# EAGLE board CFT-PB2-smd-old (EAGLE 5.11)
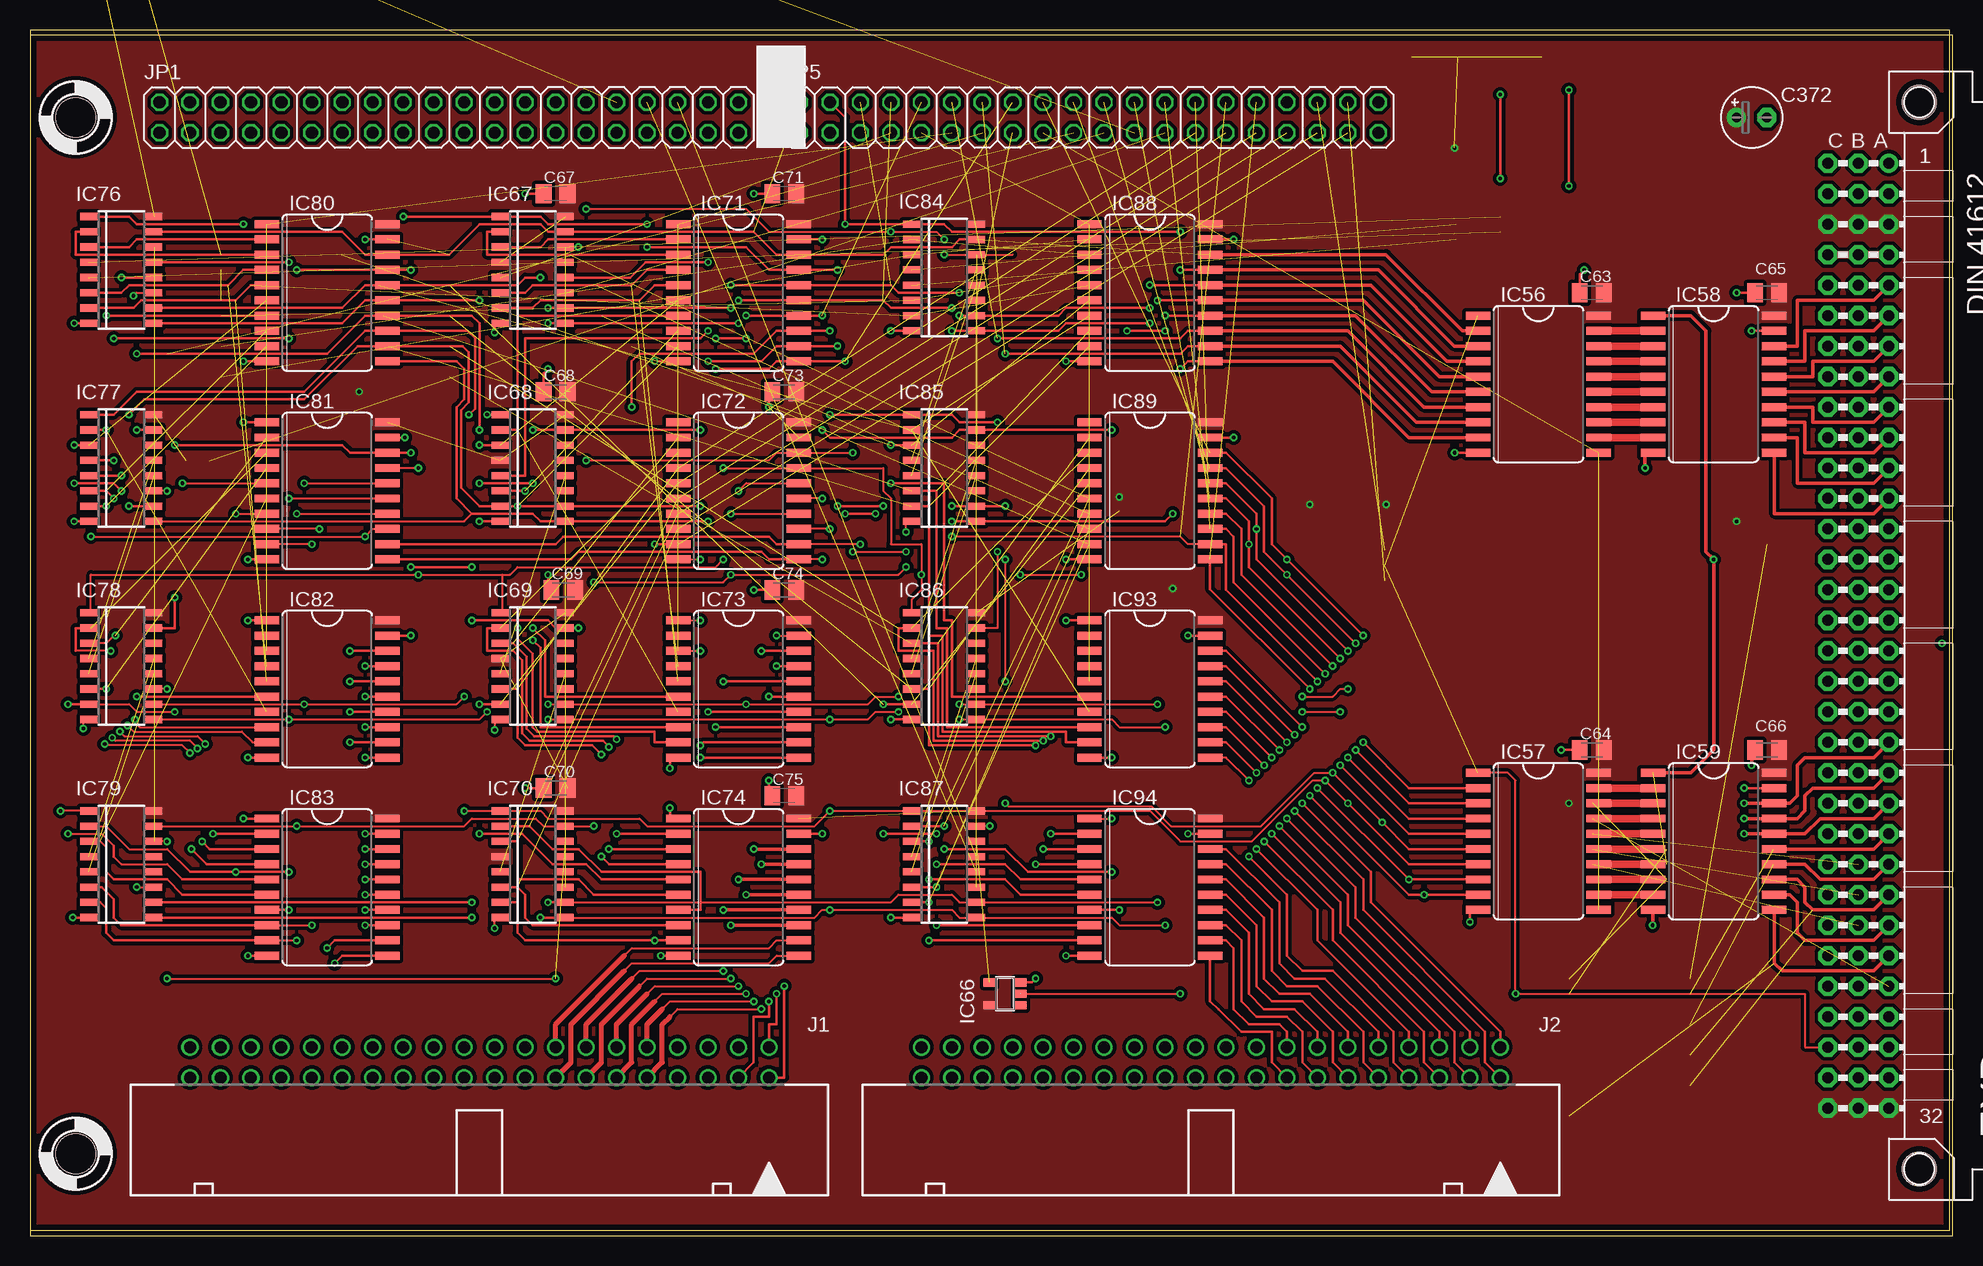
[diagram p6: board, top side]
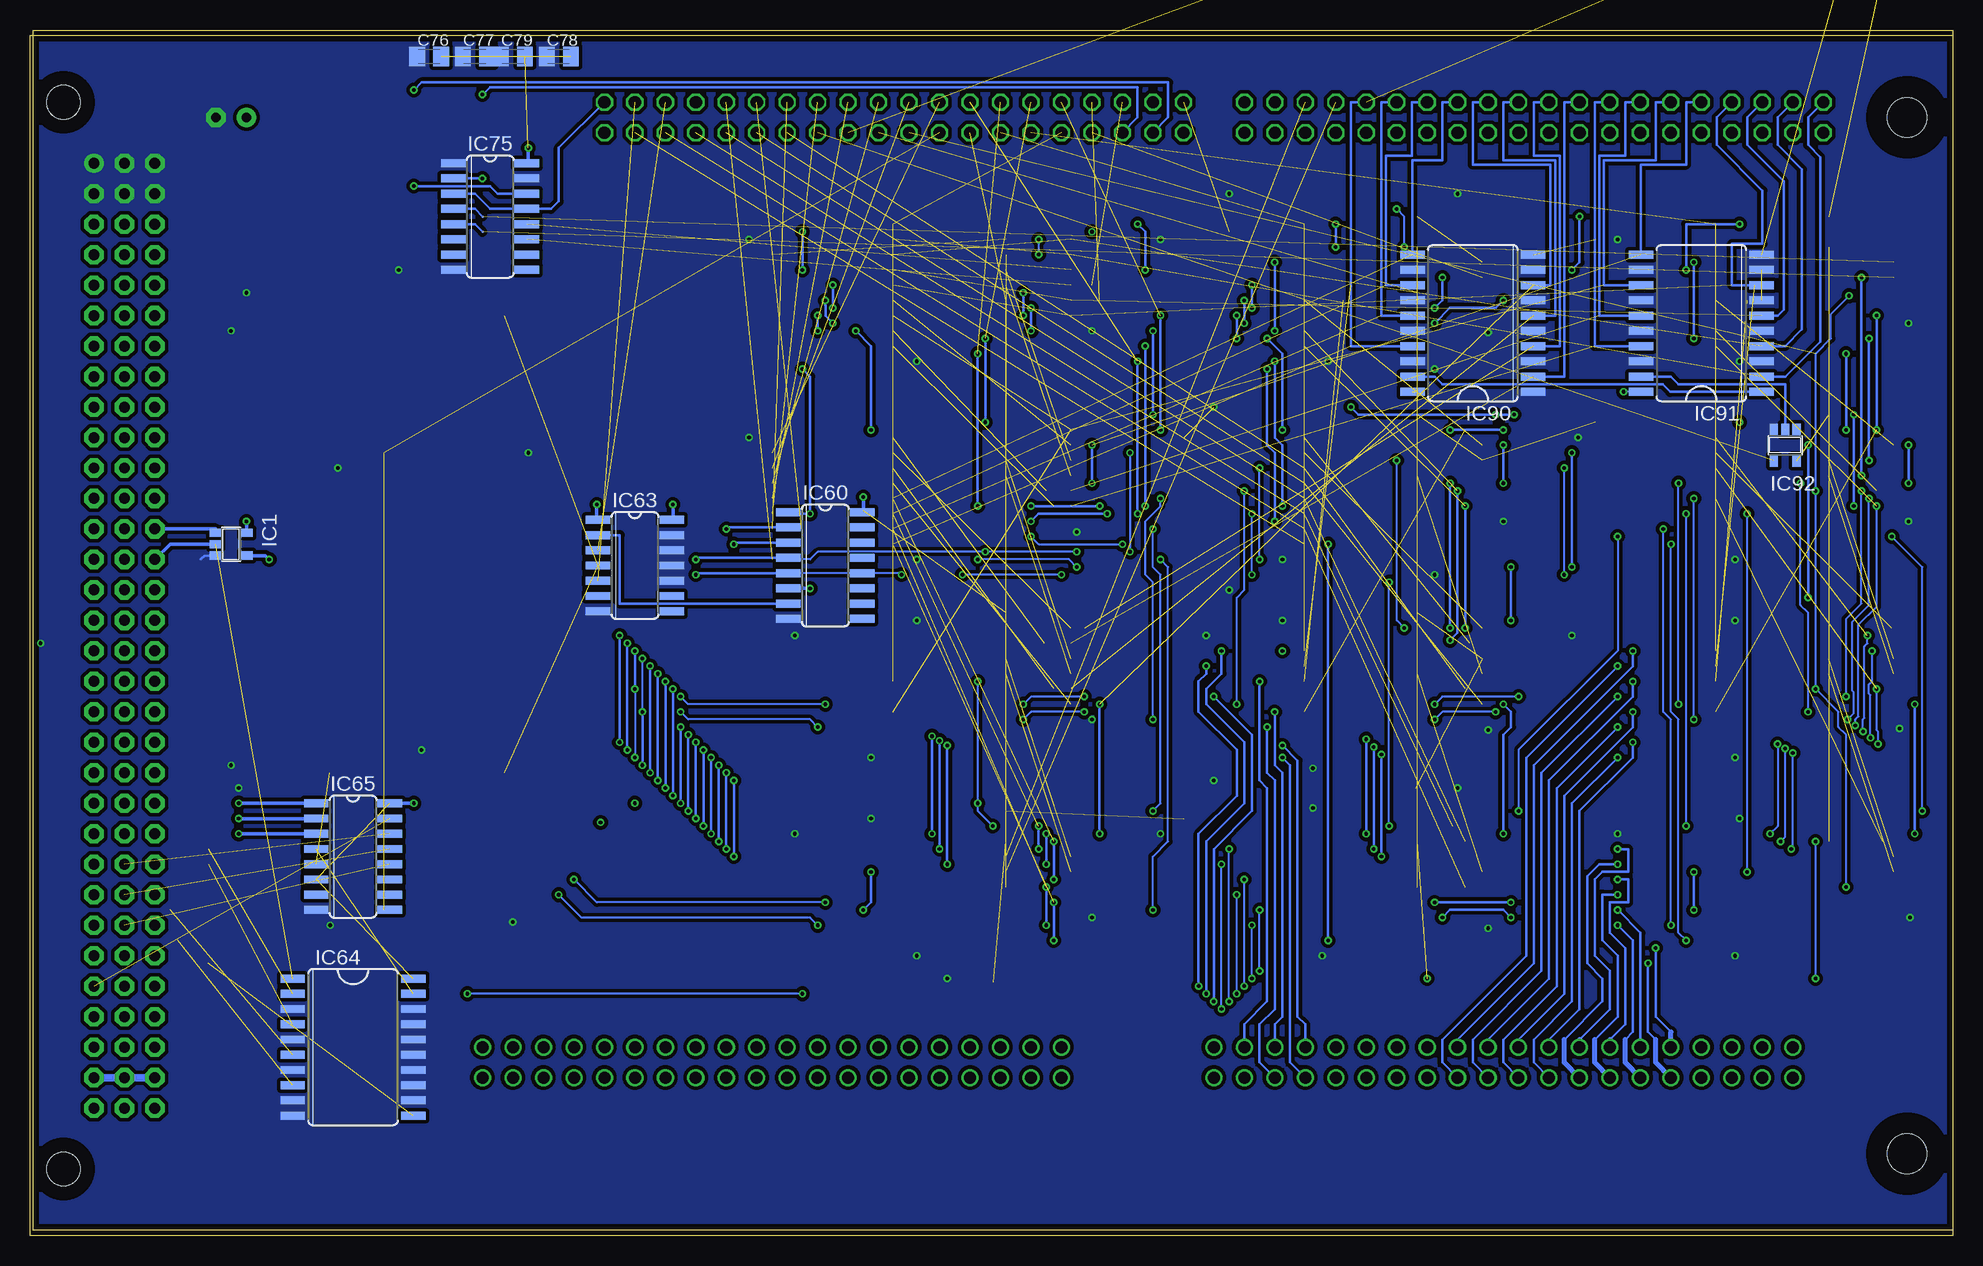
[diagram p7: board, bottom side, seen from below]

Size 160 x 100 mm. Coordinates in mm from the lower left corner, seen from the top.
Outline: 0,0 160,0 160,100 0,100 0,0
Copper layers (1*16): Top 0.035mm / dielectric 0.2mm / Bottom 0.035mm
Design rules "Myro-4mil-4layer *": minimum track width 4mil, minimum drill 6mil, track to track 4mil, track to pad 4mil, pad to pad 4mil, via to via 4mil, smd to smd 4mil, copper to edge 20mil, drill to drill 8mil, minimum pad ring 8mil, minimum via ring 6mil, stop-mask expansion 3mil, vias tented up to drill 0mil, thermal gap 8mil
Net classes: 0 default: width 0.305 mm, clearance 0.203 mm; 1 low power: width 1.27 mm, clearance 0.254 mm; 2 LED power: width 1.93 mm, clearance 0.254 mm

## Footprints (pad centres in the part's own frame; a part is rotated, then mirrored left to right if it is on the bottom)
C0805K = smd 1.3 x 1.6: 1 -1,0; 2 1,0
C025-024X044 = drill 0.813 octagon: 1 -1.27,0; 2 1.27,0
E2,5-5 = drill 0.813 pad 1.6 round: + -1.27,0 | drill 0.813 pad 1.6 octagon: - 1.27,0
VG96K = drill 0.914 pad 1.6 round: A1 154.94,39.37 | drill 0.914 pad 1.6 octagon: A2 154.94,36.83; A3 154.94,34.29; A4 154.94,31.75; A5 154.94,29.21; A6 154.94,26.67; A7 154.94,24.13; A8 154.94,21.59; A9 154.94,19.05; A10 154.94,16.51; A11 154.94,13.97; A12 154.94,11.43; A13 154.94,8.89; A14 154.94,6.35; A15 154.94,3.81; A16 154.94,1.27; A17 154.94,-1.27; A18 154.94,-3.81; A19 154.94,-6.35; A20 154.94,-8.89; A21 154.94,-11.43; A22 154.94,-13.97; A23 154.94,-16.51; A24 154.94,-19.05; A25 154.94,-21.59; A26 154.94,-24.13; A27 154.94,-26.67; A28 154.94,-29.21; A29 154.94,-31.75; A30 154.94,-34.29; A31 154.94,-36.83; A32 154.94,-39.37; B1 152.4,39.37; B2 152.4,36.83; B3 152.4,34.29; B4 152.4,31.75; B5 152.4,29.21; B6 152.4,26.67; B7 152.4,24.13; B8 152.4,21.59; B9 152.4,19.05; B10 152.4,16.51; B11 152.4,13.97; B12 152.4,11.43; B13 152.4,8.89; B14 152.4,6.35; B15 152.4,3.81; B16 152.4,1.27; B17 152.4,-1.27; B18 152.4,-3.81; B19 152.4,-6.35; B20 152.4,-8.89; B21 152.4,-11.43; B22 152.4,-13.97; B23 152.4,-16.51; B24 152.4,-19.05; B25 152.4,-21.59; B26 152.4,-24.13; B27 152.4,-26.67; B28 152.4,-29.21; B29 152.4,-31.75; B30 152.4,-34.29; B31 152.4,-36.83; B32 152.4,-39.37; C1 149.86,39.37; C2 149.86,36.83; C3 149.86,34.29; C4 149.86,31.75; C5 149.86,29.21; C6 149.86,26.67; C7 149.86,24.13; C8 149.86,21.59; C9 149.86,19.05; C10 149.86,16.51; C11 149.86,13.97; C12 149.86,11.43; C13 149.86,8.89; C14 149.86,6.35; C15 149.86,3.81; C16 149.86,1.27; C17 149.86,-1.27; C18 149.86,-3.81; C19 149.86,-6.35; C20 149.86,-8.89; C21 149.86,-11.43; C22 149.86,-13.97; C23 149.86,-16.51; C24 149.86,-19.05; C25 149.86,-21.59; C26 149.86,-24.13; C27 149.86,-26.67; C28 149.86,-29.21; C29 149.86,-31.75; C30 149.86,-34.29; C31 149.86,-36.83; C32 149.86,-39.37 | hole 2.794: 157.48,44.45; 157.48,-44.45
STANDOFF_28_60 = hole 3.302: 0,0
SOT23-5 = smd 0.69 x 0.99: 1 -0.95,-1.29; 2 0,-1.29; 3 0.95,-1.29; 4 0.95,1.3; 5 -0.95,1.3
SO20W = smd 0.66 x 2.032: 1 -5.715,-5.029; 2 -4.445,-5.029; 3 -3.175,-5.029; 4 -1.905,-5.029; 5 -0.635,-5.029; 6 0.635,-5.029; 7 1.905,-5.029; 8 3.175,-5.029; 9 4.445,-5.029; 10 5.715,-5.029; 11 5.715,5.029; 12 4.445,5.029; 13 3.175,5.029; 14 1.905,5.029; 15 0.635,5.029; 16 -0.635,5.029; 17 -1.905,5.029; 18 -3.175,5.029; 19 -4.445,5.029; 20 -5.715,5.029
SO16 = smd 0.66 x 2.032: 1 -4.445,-3.073; 2 -3.175,-3.073; 3 -1.905,-3.073; 4 -0.635,-3.073; 5 0.635,-3.073; 6 1.905,-3.073; 7 3.175,-3.073; 8 4.445,-3.073; 9 4.445,3.073; 10 3.175,3.073; 11 1.905,3.073; 12 0.635,3.073; 13 -0.635,3.073; 14 -1.905,3.073; 15 -3.175,3.073; 16 -4.445,3.073
SO14 = smd 0.66 x 2.032: 1 -3.81,-3.073; 2 -2.54,-3.073; 3 -1.27,-3.073; 4 0,-3.073; 5 1.27,-3.073; 6 2.54,-3.073; 7 3.81,-3.073; 8 3.81,3.073; 9 2.54,3.073; 10 1.27,3.073; 11 0,3.073; 12 -1.27,3.073; 13 -2.54,3.073; 14 -3.81,3.073
SO16D = smd 0.6 x 1.4: 1 -4.445,-2.715; 2 -3.175,-2.715; 3 -1.905,-2.715; 4 -0.635,-2.715; 5 0.635,-2.715; 6 1.905,-2.715; 7 3.175,-2.715; 8 4.445,-2.715; 9 4.445,2.715; 10 3.175,2.715; 11 1.905,2.715; 12 0.635,2.715; 13 -0.635,2.715; 14 -1.905,2.715; 15 -3.175,2.715; 16 -4.445,2.715
PAK100/2500-5-40 = drill 1 pad 1.422 round: 1 -24.13,-1.27; 2 -24.13,1.27; 3 -21.59,-1.27; 4 -21.59,1.27; 5 -19.05,-1.27; 6 -19.05,1.27; 7 -16.51,-1.27; 8 -16.51,1.27; 9 -13.97,-1.27; 10 -13.97,1.27; 11 -11.43,-1.27; 12 -11.43,1.27; 13 -8.89,-1.27; 14 -8.89,1.27; 15 -6.35,-1.27; 16 -6.35,1.27; 17 -3.81,-1.27; 18 -3.81,1.27; 19 -1.27,-1.27; 20 -1.27,1.27; 21 1.27,-1.27; 22 1.27,1.27; 23 3.81,-1.27; 24 3.81,1.27; 25 6.35,-1.27; 26 6.35,1.27; 27 8.89,-1.27; 28 8.89,1.27; 29 11.43,-1.27; 30 11.43,1.27; 31 13.97,-1.27; 32 13.97,1.27; 33 16.51,-1.27; 34 16.51,1.27; 35 19.05,-1.27; 36 19.05,1.27; 37 21.59,-1.27; 38 21.59,1.27; 39 24.13,-1.27; 40 24.13,1.27
2X20 = drill 1.016 octagon: 1 -24.13,-1.27; 2 -24.13,1.27; 3 -21.59,-1.27; 4 -21.59,1.27; 5 -19.05,-1.27; 6 -19.05,1.27; 7 -16.51,-1.27; 8 -16.51,1.27; 9 -13.97,-1.27; 10 -13.97,1.27; 11 -11.43,-1.27; 12 -11.43,1.27; 13 -8.89,-1.27; 14 -8.89,1.27; 15 -6.35,-1.27; 16 -6.35,1.27; 17 -3.81,-1.27; 18 -3.81,1.27; 19 -1.27,-1.27; 20 -1.27,1.27; 21 1.27,-1.27; 22 1.27,1.27; 23 3.81,-1.27; 24 3.81,1.27; 25 6.35,-1.27; 26 6.35,1.27; 27 8.89,-1.27; 28 8.89,1.27; 29 11.43,-1.27; 30 11.43,1.27; 31 13.97,-1.27; 32 13.97,1.27; 33 16.51,-1.27; 34 16.51,1.27; 35 19.05,-1.27; 36 19.05,1.27; 37 21.59,-1.27; 38 21.59,1.27; 39 24.13,-1.27; 40 24.13,1.27
SIGNAL-RENAME = smd 0.305 x 0.152: P$1 0,0; P$2 0,0

## Placement (x,y rotation side)
C63  0.1uF  [C0805K]  130.18,78.11 0 top
C64  0.1uF  [C0805K]  130.18,40.01 0 top
C65  0.1uF  [C0805K]  144.78,78.11 0 top
C66  0.1uF  [C0805K]  144.78,40.01 0 top
C67  0.1uF  [C0805K]  43.81,86.36 0 top
C68  0.1uF  [C0805K]  43.81,69.85 0 top
C69  0.1uF  [C0805K]  44.45,53.34 0 top
C70  0.1uF  [C0805K]  43.81,36.83 0 top
C71  0.1uF  [C0805K]  62.87,86.36 0 top
C72  1uF  [C025-024X044]  -59.69,200.66 0 top  (outside the outline)
C73  0.1uF  [C0805K]  62.87,69.85 0 top
C74  0.1uF  [C0805K]  62.87,53.34 0 top
C75  0.1uF  [C0805K]  62.87,36.2 0 top
C76  0.1uF  [C0805K]  127,97.79 0 bottom
C77  0.1uF  [C0805K]  123.19,97.79 0 bottom
C78  0.1uF  [C0805K]  116.2,97.79 0 bottom
C79  0.1uF  [C0805K]  120.02,97.79 0 bottom
C80  0.1uF  [C025-024X044]  -121.92,193.04 0 top  (outside the outline)
C81  1uF  [C025-024X044]  -64.77,200.66 0 top  (outside the outline)
C82  0.1uF  [C025-024X044]  -128.27,193.04 0 top  (outside the outline)
C83  0.1uF  [C025-024X044]  -134.62,193.04 0 top  (outside the outline)
C84  0.1uF  [C025-024X044]  -140.97,193.04 0 top  (outside the outline)
C85  0.1uF  [C025-024X044]  -147.32,193.04 0 top  (outside the outline)
C86  0.1uF  [C025-024X044]  -153.67,193.04 0 top  (outside the outline)
C87  0.1uF  [C025-024X044]  -160.02,193.04 0 top  (outside the outline)
C88  0.1uF  [C025-024X044]  -166.37,193.04 0 top  (outside the outline)
C89  0.1uF  [C025-024X044]  -172.72,193.04 0 top  (outside the outline)
C90  1uF  [C025-024X044]  -69.85,200.66 0 top  (outside the outline)
C91  0.1uF  [C025-024X044]  -179.07,193.04 0 top  (outside the outline)
C92  0.1uF  [C025-024X044]  -185.42,193.04 0 top  (outside the outline)
C93  0.1uF  [C025-024X044]  -191.77,193.04 0 top  (outside the outline)
C94  0.1uF  [C025-024X044]  -198.12,193.04 0 top  (outside the outline)
C95  0.1uF  [C025-024X044]  -16.51,200.66 0 top  (outside the outline)
C96  0.1uF  [C025-024X044]  -22.86,200.66 0 top  (outside the outline)
C97  0.1uF  [C025-024X044]  -29.21,200.66 0 top  (outside the outline)
C98  0.1uF  [C025-024X044]  -35.56,200.66 0 top  (outside the outline)
C99  0.1uF  [C025-024X044]  -41.91,200.66 0 top  (outside the outline)
C100  0.1uF  [C025-024X044]  -48.26,200.66 0 top  (outside the outline)
C101  1uF  [C025-024X044]  -54.61,200.66 0 top  (outside the outline)
C372  1uF  [E2,5-5]  143.51,92.71 0 top
EXP  [VG96K]  0,49.53 0 top
H1  HOLE  [STANDOFF_28_60]  -76.2,200.66 0 top  (outside the outline)
H2  HOLE  [STANDOFF_28_60]  -82.55,200.66 0 top  (outside the outline)
H3  HOLE  [STANDOFF_28_60]  3.81,6.35 0 top
H4  HOLE  [STANDOFF_28_60]  3.81,92.71 0 top
IC1  74AHC1G08DBV  [SOT23-5]  143.51,57.15 270 bottom
IC56  74HC574D  [SO20W]  125.73,70.48 270 top
IC57  74HC574D  [SO20W]  125.73,32.38 270 top
IC58  74HC541DW  [SO20W]  140.34,70.48 270 top
IC59  74HC541DW  [SO20W]  140.34,32.38 270 top
IC60  74HC138D  [SO16]  93.98,55.37 270 bottom
IC63  74HC74D  [SO14]  109.86,55.37 270 bottom
IC64  74HC688DW  [SO20W]  133.35,15.24 270 bottom
IC65  74HC138D  [SO16]  133.35,31.11 270 bottom
IC66  74AHC1G04DBV  [SOT23-5]  81.28,19.68 90 top
IC67  74HC193D  [SO16D]  41.91,80.01 270 top
IC68  74HC193D  [SO16D]  41.91,63.5 270 top
IC69  74HC193D  [SO16D]  41.91,46.99 270 top
IC70  74HC193D  [SO16D]  41.91,30.48 270 top
IC71  74HC541DW  [SO20W]  59.05,78.11 270 top
IC72  74HC541DW  [SO20W]  59.05,61.59 270 top
IC73  74HC541DW  [SO20W]  59.05,45.09 270 top
IC74  74HC541DW  [SO20W]  59.05,28.57 270 top
IC75  74HC139D  [SO16]  121.92,84.45 270 bottom
IC76  74HC193D  [SO16D]  7.62,80.01 270 top
IC77  74HC193D  [SO16D]  7.62,63.5 270 top
IC78  74HC193D  [SO16D]  7.62,46.99 270 top
IC79  74HC193D  [SO16D]  7.62,30.48 270 top
IC80  74HC541DW  [SO20W]  24.77,78.11 270 top
IC81  74HC541DW  [SO20W]  24.77,61.59 270 top
IC82  74HC541DW  [SO20W]  24.77,45.09 270 top
IC83  74HC541DW  [SO20W]  24.77,28.57 270 top
IC84  74HC193D  [SO16D]  76.2,79.38 270 top
IC85  74HC193D  [SO16D]  76.2,63.5 270 top
IC86  74HC193D  [SO16D]  76.2,46.99 270 top
IC87  74HC193D  [SO16D]  76.2,30.48 270 top
IC88  74HC541DW  [SO20W]  93.34,78.11 270 top
IC89  74HC541DW  [SO20W]  93.34,61.59 270 top
IC90  74HC688DW  [SO20W]  40.01,75.56 90 bottom
IC91  74HC688DW  [SO20W]  20.95,75.56 90 bottom
IC92  74AHC1G04DBV  [SOT23-5]  13.97,65.41 180 bottom
IC93  74HC541DW  [SO20W]  93.34,45.09 270 top
IC94  74HC541DW  [SO20W]  93.34,28.57 270 top
J1  2540-5  [PAK100/2500-5-40]  37.47,13.97 180 top
J2  2540-5  [PAK100/2500-5-40]  98.42,13.97 180 top
JP1  [2X20]  34.92,92.71 0 top
JP5  [2X20]  88.27,92.71 0 top
X1  SIGNAL-RENAME  [SIGNAL-RENAME]  -193.04,198.12 0 top  (outside the outline)

## Tracks (layer width: path | path; a pad name or v marks a point on that pad's centre or on a via)
!ABEN  (via drill 0.3)  (1 unrouted)
  Top 0.305: IC58.1 138.43,76.2 139.7,74.93 139.7,56.52 v140.34,55.88 140.34,40.01 138.43,38.1 IC59.1
  Bottom 0.305: IC1.4 140.66,56.2 v140.34,55.88
!ACB1  (1 unrouted)
!ACB2  (1 unrouted)
!ACB3  (1 unrouted)
!ACC1  (1 unrouted)
!ACC2  (1 unrouted)
!ACC3  (1 unrouted)
!ACDOWN  (1 unrouted)
!ACUP  (1 unrouted)
!AINDEX  (1 unrouted)
!DEC
  Bottom 0.203: IC75.3 123.19,86.36 121.92,85.09 IC75.13 116.84,85.09 116.2,85.72 116.2,90.17 JP5.40
!DECCPL  (1 unrouted)
!DRB1  (via drill 0.3)
  Top 0.203: IC77.4 v6.99,64.14 | v6.99,74.3 v21.59,74.3 | v21.59,80.64 IC76.13
  Bottom 0.203: v6.99,64.14 v6.99,74.3 | v21.59,74.3 v21.59,80.64
!DRB2  (1 unrouted)
!DRB3  (1 unrouted)
!DRC1  (via drill 0.3)
  Top 0.203: IC77.5 v7.62,62.87 | v7.62,79.38 IC76.12
  Bottom 0.203: v7.62,62.87 v7.62,79.38
!DRC2  (1 unrouted)
!DRC3  (1 unrouted)
!DRDOWN  (1 unrouted)
  Bottom 0.203: IC75.4 123.19,85.09 122.56,84.45
!DRUP  (1 unrouted)
  Bottom 0.203: IC75.5 123.19,83.82 122.56,83.19
!FZERO
  Bottom 0.203: IC91.19 23.5,71.12 22.86,70.48 13.97,70.48 IC92.2
!INCCPL  (1 unrouted)
!INCPC  (1 unrouted)
!IO  (1 unrouted)
  Bottom 0.305: IC1.2 148.59,57.15 EXP.C14
!IODEV1XX  (1 unrouted)
!IODEV2XX  (1 unrouted)
!IODEV3XX  (1 unrouted)
!IS_AUTOINDEX
  Bottom 0.203: IC63.2 111.12,57.91 111.12,52.2 IC60.7
!MEM
  Bottom 0.305: IC1.1 144.8,58.42 EXP.C13
!RAC  (2 unrouted)
!RDR  (via drill 0.3)  (2 unrouted)
  Top 0.203: IC81.1 v17.78,67.31
!RESET  (via drill 0.3)  (2 unrouted)
  Top 0.152: IC66.2 v95.89,19.68 | IC57.1 123.19,38.1 123.83,37.47 v123.83,19.68 147.96,19.68 147.96,15.24 EXP.C30
  Bottom 0.152: v95.89,19.68 v123.83,19.68
!RPC  (2 unrouted)
!STPAC  (via drill 0.3)
  Top 0.203: v128.27,95 v128.27,87
  Bottom 0.203: JP5.3 65.41,92.71 65.41,95.63 127.64,95.63 v128.27,95 | v128.27,87 121.92,87 121.28,86.36 IC75.14
!STPDR  (via drill 0.3)
  Top 0.203: v122.56,94.61 v122.56,87.63
  Bottom 0.203: JP5.5 67.94,92.71 67.94,95.25 121.92,95.25 v122.56,94.61 | v122.56,87.63 IC75.2
!SYSDEV  (1 unrouted)
!WAC  (4 unrouted)
!WAR  (2 unrouted)
!WDR  (via drill 0.3)  (1 unrouted)
  Top 0.152: v8.89,28.57 IC79.11 | v11.43,45.09 IC78.11 | v11.43,61.59 IC77.11 | v8.64,77.85 8.89,78.11 IC76.11
  Bottom 0.152: v8.89,28.57 8.89,41.27 9.53,41.91 9.53,43.18 v11.43,45.09 v11.43,61.59 11.43,73.03 10.16,74.3 10.16,76.33 v8.64,77.85
!WIR  (1 unrouted)
!WPC  (4 unrouted)
+3.3V
  Top 0.61: EXP.C4 EXP.B4 EXP.A4
+12V
  Bottom 0.61: EXP.C31 EXP.B31 EXP.A31
AB0
  Top 0.305: IC58.18 147.32,73.66 147.32,77.47 153.67,77.47 EXP.A5
AB1
  Top 0.305: IC58.17 147.96,72.39 147.96,74.93 153.67,74.93 EXP.A6
AB2
  Top 0.305: IC58.16 148.59,71.12 148.59,72.39 153.67,72.39 EXP.A7
AB3
  Top 0.305: IC58.15 153.67,69.85 EXP.A8
AB4
  Top 0.305: IC58.14 148.59,68.58 148.59,67.31 153.67,67.31 EXP.A9
AB5
  Top 0.305: IC58.13 147.96,67.31 147.96,64.77 153.67,64.77 EXP.A10
AB6
  Top 0.305: IC58.12 147.32,66.04 147.32,62.23 153.67,62.23 EXP.A11
AB7
  Top 0.305: IC58.11 145.41,64.77 145.41,59.69 153.67,59.69 EXP.A12
AB8  (via drill 0.3)
  Top 0.305: EXP.A20 153.67,39.37 147.96,39.37 147.32,38.73 147.32,36.2 146.69,35.56 IC59.18 v142.88,35.56
  Bottom 0.305: IC65.1 v142.88,35.56
AB9  (via drill 0.3)
  Top 0.305: EXP.A21 153.67,36.83 148.59,36.83 147.96,36.2 147.96,34.92 147.32,34.29 IC59.17 v142.88,34.29
  Bottom 0.305: IC65.2 v142.88,34.29
AB10  (via drill 0.3)
  Top 0.305: EXP.A22 153.67,34.29 149.22,34.29 147.96,33.02 IC59.16 v142.88,33.02
  Bottom 0.305: IC65.3 v142.88,33.02
AB11  (1 unrouted)
  Top 0.305: IC59.15 153.67,31.75 EXP.A23
AB12  (1 unrouted)
  Top 0.305: IC59.14 147.96,30.48 149.22,29.21 153.67,29.21 EXP.A24
AB13  (1 unrouted)
  Top 0.305: IC59.13 147.32,29.21 147.96,28.57 147.96,27.3 148.59,26.67 153.67,26.67 EXP.A25
AB14  (1 unrouted)
  Top 0.305: IC59.12 146.69,27.94 147.32,27.3 147.32,24.77 147.96,24.13 153.67,24.13 EXP.A26
AB15  (1 unrouted)
  Top 0.305: IC59.11 145.41,26.67 145.41,22.23 146.05,21.59 153.67,21.59 EXP.A27
AC0  (3 unrouted)
  Bottom 0.203: JP1.2 12.06,92.71 12.06,90.42 11.05,89.41 11.05,74.04 13.97,71.12 IC91.2
AC1  (3 unrouted)
  Bottom 0.203: JP1.4 14.61,92.71 14.61,90.42 12.57,88.39 12.57,75.06 13.97,73.66 IC91.4
AC2  (3 unrouted)
  Bottom 0.203: JP1.6 17.14,92.71 17.14,90.42 14.1,87.38 14.1,76.71 14.61,76.2 IC91.6
AC3  (3 unrouted)
  Bottom 0.203: JP1.8 19.68,92.71 19.68,90.42 15.88,86.61 15.88,82.17 18.41,82.17 18.41,78.74 IC91.8
AC4  (via drill 0.3)  (2 unrouted)
  Top 0.203: IC93.6 76.83,44.45 76.83,50.8 76.2,50.8 76.2,62.23 v71.75,62.23 | v71.75,65.41 IC85.3
  Bottom 0.203: JP1.10 22.23,93.98 22.23,88.77 25.98,88.77 IC91.11 | v71.75,62.23 v71.75,65.41
AC5  (3 unrouted)
  Bottom 0.203: JP1.12 24.77,93.98 24.77,89.15 29.08,89.15 29.08,78.74 IC91.13
AC6  (2 unrouted)
  Top 0.203: IC93.8 76.45,41.91 76.45,50.16 75.56,50.16 75.56,61.59 IC85.6
  Bottom 0.203: JP1.14 27.3,93.98 27.3,89.53 29.46,89.53 29.46,76.2 IC91.15
AC7  (2 unrouted)
  Top 0.203: IC93.9 86.36,40.64 86.36,41.53 76.07,41.53 76.07,49.53 74.93,49.53 74.93,60.33 IC85.7
  Bottom 0.203: JP1.16 29.84,93.98 29.84,73.66 IC91.17
AC8  (via drill 0.3)  (2 unrouted)
  Top 0.203: v85.09,33.02 IC94.2 | v85.09,41.15 75.69,41.15 75.69,48.9 IC86.3
  Bottom 0.203: JP1.18 32.38,93.98 32.38,71.12 IC90.2 | v85.09,41.15 v85.09,33.02
AC9  (via drill 0.3)  (2 unrouted)
  Top 0.203: v84.45,31.75 IC94.3 | v84.45,40.77 75.31,40.77 75.31,48.26 72.39,48.26 72.39,50.16 IC86.2
  Bottom 0.203: JP1.20 34.92,93.98 34.92,89.53 32.77,89.53 32.77,73.66 IC90.4 | v84.45,31.75 v84.45,40.77
AC10  (via drill 0.3)  (2 unrouted)
  Top 0.203: v83.82,30.48 IC94.4 | v83.82,40.39 74.93,40.39 74.93,45.09 IC86.6
  Bottom 0.203: JP1.22 37.47,93.98 37.47,89.15 33.15,89.15 33.15,76.2 IC90.6 | v83.82,40.39 v83.82,30.48
AC11  (via drill 0.3)  (2 unrouted)
  Top 0.203: IC94.5 82.55,29.21 81.28,30.48 v75.56,30.48 | v75.56,33.02 v71.12,33.02 | v71.12,43.81 IC86.7
  Bottom 0.203: JP1.24 40.01,93.98 40.01,88.77 33.53,88.77 33.53,78.74 IC90.8 | v75.56,30.48 v75.56,33.02 | v71.12,33.02 v71.12,43.81
AC12  (via drill 0.3)  (2 unrouted)
  Top 0.203: IC94.6 82.55,27.94 81.28,29.21 v74.93,29.21 | IC87.3 v74.93,32.38
  Bottom 0.203: JP1.26 42.55,93.98 42.55,89.15 45.03,89.15 IC90.11 | v74.93,32.38 v74.93,29.21
AC13  (via drill 0.3)  (2 unrouted)
  Top 0.203: v90.81,26.67 IC94.7 | v90.17,29.84 83.19,29.84 81.28,31.75 v76.2,31.75 | IC87.2 v76.2,33.66
  Bottom 0.203: JP1.28 45.09,93.98 45.09,89.53 47.24,89.53 47.24,78.74 IC90.13 | v90.17,29.84 90.17,27.3 v90.81,26.67 | v76.2,33.66 v76.2,31.75
AC14  (via drill 0.3)  (2 unrouted)
  Top 0.203: IC87.6 v75.56,28.57 | v75.56,25.4 IC94.8
  Bottom 0.203: JP1.30 47.62,93.98 47.62,76.2 IC90.15 | v75.56,28.57 v75.56,25.4
AC15  (via drill 0.3)  (3 unrouted)
  Top 0.203: IC87.7 v74.93,27.3 | v74.93,24.13 IC94.9
  Bottom 0.203: JP1.32 50.16,93.98 50.16,73.66 IC90.17 | v74.93,27.3 v74.93,24.13
AR0
  Top 0.61: IC56.19 IC58.2
AR1
  Top 0.61: IC56.18 IC58.3
AR2
  Top 0.61: IC56.17 IC58.4
AR3
  Top 0.61: IC56.16 IC58.5
AR4
  Top 0.61: IC56.15 IC58.6
AR5
  Top 0.61: IC56.14 IC58.7
AR6
  Top 0.61: IC56.13 IC58.8
AR7
  Top 0.61: IC56.12 IC58.9
AR8
  Top 0.61: IC57.19 IC59.2
AR9
  Top 0.61: IC57.18 IC59.3
AR10
  Top 0.61: IC57.17 IC59.4
AR11
  Top 0.61: IC57.16 IC59.5
AR12
  Top 0.61: IC57.15 IC59.6
AR13
  Top 0.61: IC57.14 IC59.7
AR14
  Top 0.61: IC57.13 IC59.8
AR15
  Top 0.61: IC57.12 IC59.9
DR0  (1 unrouted)
  Top 0.203: IC76.3 8.26,81.92 8.89,82.55 IC80.2
DR1  (1 unrouted)
  Top 0.203: IC76.2 3.81,83.19 3.81,81.28 IC80.3
DR2  (1 unrouted)
  Top 0.203: IC76.6 7.62,78.11 8.26,78.74 16.51,78.74 17.78,80.01 IC80.4
DR3  (1 unrouted)
  Top 0.203: IC76.7 8.64,76.83 9.27,77.47 17.14,77.47 18.41,78.74 IC80.5
DR4  (via drill 0.3)  (1 unrouted)
  Top 0.203: v8.89,44.45 IC82.6 | v7.62,61.59 6.99,62.23 v3.68,62.23 | v3.68,65.41 IC77.3
  Bottom 0.152: v8.89,44.45 8.89,50.93 7.62,52.2 v7.62,61.59
  Bottom 0.203: v3.68,62.23 v3.68,65.41
DR5  (via drill 0.3)  (1 unrouted)
  Top 0.203: IC77.2 v6.35,66.67 | v6.35,76.2 IC80.7
  Bottom 0.203: v6.35,66.67 v6.35,76.2
DR6  (via drill 0.3)  (1 unrouted)
  Top 0.152: v8.76,42.55 8.76,42.29 9.14,41.91 IC82.8
  Top 0.203: v6.99,60.96 6.35,61.59 IC77.6
  Bottom 0.152: v8.76,42.55 8.26,43.05 8.26,44.83 8.38,44.96 8.38,50.67 6.99,52.07 v6.99,60.96
DR7  (via drill 0.3)  (1 unrouted)
  Top 0.152: IC82.9 18.54,40.64 17.65,41.53 8.64,41.53 v8.13,42.04
  Top 0.203: v6.35,60.33 IC77.7
  Bottom 0.152: v8.13,42.04 8.13,42.55 7.87,42.8 7.87,50.42 6.35,51.94 v6.35,60.33
DR8  (via drill 0.3)  (1 unrouted)
  Top 0.152: v7.11,49.53 6.99,49.53 6.35,48.9 IC78.3 | v14.61,40.51 13.97,41.15 7.87,41.15 v7.49,41.53
  Top 0.203: v15.24,33.02 IC83.2
  Bottom 0.152: v7.49,41.53 7.49,42.55 7.37,42.67 7.37,48.64 7.11,48.9 v7.11,49.53 | v14.61,40.51 14.61,33.66 v15.24,33.02
DR9  (via drill 0.3)  (1 unrouted)
  Top 0.152: v13.97,40.13 13.34,40.77 7.11,40.77 v6.86,41.02 | v6.73,48.26 3.81,48.26
  Top 0.203: IC83.3 14.99,31.75 v14.35,32.38 | 3.81,48.26 3.81,50.16 IC78.2 5.08,50.16
  Bottom 0.152: v14.35,32.38 13.97,32.77 v13.97,40.13 | v6.86,41.02 6.86,44.58 6.99,44.7 6.99,45.47 6.73,45.72 v6.73,48.26
DR10  (via drill 0.3)  (1 unrouted)
  Top 0.152: v13.34,39.75 12.7,40.39 6.48,40.39 v6.22,40.51
  Top 0.203: v6.35,45.09 IC78.6 | v13.46,31.75 14.73,30.48 IC83.4
  Bottom 0.152: v6.35,45.09 6.35,41.66 6.22,41.53 v6.22,40.51 | v13.46,31.75 13.34,31.88 v13.34,39.75
DR11  (via drill 0.3)
  Top 0.152: 11.43,30.48 7.62,30.48 6.99,31.11 | 6.99,32 5.97,33.02 v3.17,33.02 | IC78.7 8.26,43.81 8.89,43.18 v12.06,43.18 | v12.7,62.23 IC81.5
  Top 0.203: IC83.5 12.7,29.21 11.43,30.48 | 6.99,32 6.99,31.11 | v3.17,43.81 IC78.7
  Bottom 0.152: v12.06,43.18 12.06,51.44 12.7,52.07 v12.7,62.23
  Bottom 0.203: v3.17,33.02 v3.17,43.81
DR12  (1 unrouted)
  Top 0.152: 6.35,31.88 5.84,32.38 IC79.3 | 6.35,29.84 6.99,29.21
  Top 0.203: IC83.6 12.7,27.94 11.43,29.21 6.99,29.21 | 6.35,31.88 6.35,29.84
DR13  (via drill 0.3)
  Top 0.152: 11.43,31.75 8.26,31.75 6.35,33.66 IC79.2 | v17.14,59.69 IC81.7
  Top 0.203: v21.59,26.67 IC83.7 | v21.59,29.84 v17.14,29.84 13.34,29.84 11.43,31.75
  Bottom 0.152: v17.14,29.84 v17.14,59.69
  Bottom 0.203: v21.59,29.84 v21.59,26.67
DR14  (via drill 0.3)
  Top 0.152: v24.13,58.42 IC81.8 | IC83.8 v23.5,25.4
  Top 0.203: IC79.6 5.97,28.57 6.99,27.56 6.99,26.04 7.62,25.4 IC83.8
  Bottom 0.152: v24.13,58.42 24.13,43.18 23.5,42.55 v23.5,25.4
DR15  (via drill 0.3)
  Top 0.152: v23.5,57.15 IC81.9 | IC83.9 v22.23,24.13
  Top 0.203: IC79.7 5.84,27.3 6.35,26.8 6.35,24.77 6.99,24.13 IC83.9
  Bottom 0.152: v23.5,57.15 23.5,43.18 22.86,42.55 22.86,24.77 v22.23,24.13
FNEG  (1 unrouted)
FZERO  (1 unrouted)
GND  (via drill 0.3)  (26 unrouted)
  Top 0.152: IC85.8 73.03,59.05 v73.03,58.17 | IC72.10 v55.88,55.88 | IC94.1 v90.17,34.29 | v62.23,49.53 IC73.19 | IC73.1 v55.88,50.8 | IC78.8 4.45,42.55 v4.45,41.78 | IC70.8 38.73,26.04 v38.73,25.15 | IC69.8 38.73,42.55 v38.73,41.66
  Top 0.203: v52.58,22.86 IC74.10 | v53.34,38.48 53.34,39.37 IC73.10 | v60.33,53.34 C74.1 | C68.1 42.81,71.39 v43.18,71.75 | v37.47,59.05 IC68.8 | IC79.8 v3.56,26.04 | IC83.10 v18.16,22.86 | C70.1 v41.27,36.83 | v53.34,35.18 53.34,34.29 IC74.1 | IC74.19 v66.04,33.02 | 62.23,69.85 C73.1 61.87,69.48 61.59,69.22 v61.59,68.58 | v60.33,86.36 C71.1 | IC71.19 v66.04,82.55 | C67.1 v41.27,86.36 | IC76.8 v3.68,75.56 | IC77.8 v3.68,59.05 | IC82.10 v18.16,39.37 | IC81.10 v18.16,55.88 | IC88.10 v86.36,72.39 | IC84.8 v71.75,74.93 | IC80.10 v17.78,72.39 | IC93.10 v90.17,39.37 | IC89.10 v86.36,55.88 | v118.75,64.77 IC56.10 | IC57.10 120.02,26.67 v120.02,25.65 | C63.1 129.18,79.64 v129.54,80.01 | v142.88,36.83 IC59.19 | C64.1 v127.64,40.01 | C65.1 v142.24,78.11 | v143.51,74.93 IC58.19 | IC83.1 v17.78,34.29 | IC83.19 v27.94,33.02 | IC82.1 v18.16,50.8 | IC82.19 v31.75,49.53 | IC81.19 v31.24,66.04 | v52.07,72.39 IC71.10 | IC80.19 v27.94,82.55 | IC93.1 v86.36,50.8 | IC93.19 v96.52,49.53 | IC89.19 v100.33,66.04 | IC66.3 83.5,20.64 v83.82,20.95 | IC87.8 v71.75,26.04 | IC94.10 v86.36,22.86 | IC86.8 v71.75,42.55 | IC94.19 v96.52,33.02 | IC88.19 v100.33,82.55 | C75.1 61.59,36.47 v61.59,37.47 | IC67.8 38.73,75.56 v38.73,74.8 | C69.1 43.18,53.61 v43.18,54.61
  Top 0.305: v134.62,63.5 134.62,64.77 IC58.10 | C66.1 143.51,39.73 v143.51,38.73 | IC59.10 135.25,26.62 v135.25,25.4
  Bottom 0.203: IC1.3 145.73,56.2 146.05,55.88
  other vias: 159.38,48.9
  pour Bottom (isolate 0.305, no thermals): 0,100.33 0,0 160.02,0 160.02,100.33
IBUS0  (2 unrouted)
  Top 0.203: IC76.15 26.04,83.19 27.94,81.28 IC80.18 34.92,81.28 37.47,83.82 42.55,83.82 43.18,83.19 IC67.15 60.33,83.19 62.23,81.28 IC71.18 71.12,81.28 71.75,81.92 76.83,81.92 77.47,82.55 IC84.15
  Top 0.305: IC88.18 113.03,81.28 119.38,74.93 IC56.2
IBUS1  (via drill 0.3)
  Top 0.203: v95.89,83.19 76.83,83.19 76.2,83.82 IC84.1 v67.94,83.82 67.94,92.71 JP5.4 | v95.89,80.01 IC88.17 | IC76.1 8.26,84.45 8.89,83.82 v17.78,83.82 | v22.23,80.01 IC80.17 v31.75,80.01 | v31.11,84.45 IC67.1 42.55,84.45 43.18,83.82 v51.44,83.82 | v51.44,81.92 59.69,81.92 61.59,80.01 IC71.17 v67.31,80.01
  Top 0.305: IC88.17 112.39,80.01 118.75,73.66 IC56.3
  Bottom 0.203: v95.89,83.19 v95.89,80.01 | v17.78,83.82 22.23,83.82 v22.23,80.01 | v31.75,80.01 31.11,80.64 v31.11,84.45 | v51.44,83.82 v51.44,81.92 | v67.31,80.01 67.31,83.19 v67.94,83.82
IBUS2  (via drill 0.3)  (1 unrouted)
  Top 0.203: IC76.10 26.04,76.83 27.94,78.74 IC80.16 40.64,78.74 41.27,79.38 v42.55,79.38 | v43.18,76.83 IC67.10 v58.42,76.83 | v58.42,78.74 IC71.16 71.75,78.74 72.39,78.11 v77.47,78.11 | v77.47,76.2 IC84.10 85.72,76.2 86.36,76.83 v93.34,76.83 | v93.34,78.74 IC88.16
  Top 0.305: IC88.16 111.76,78.74 118.11,72.39 IC56.4
  Bottom 0.203: v42.55,79.38 42.55,77.47 v43.18,76.83 | v58.42,76.83 v58.42,78.74 | v77.47,78.11 v77.47,76.2 | v93.34,76.83 v93.34,78.74
IBUS3  (via drill 0.3)  (1 unrouted)
  Top 0.203: IC76.9 26.04,75.56 27.94,77.47 IC80.15 v37.47,77.47 | v43.18,75.56 IC67.9 v59.05,75.56 | v59.05,77.47 IC71.15 71.12,77.47 71.75,76.83 v76.83,76.83 | v76.83,74.93 IC84.9 85.72,74.93 86.36,75.56 v93.34,75.56 | v93.98,77.47 IC88.15
  Top 0.305: IC88.15 111.12,77.47 117.47,71.12 IC56.5
  Bottom 0.203: v37.47,77.47 38.1,76.83 41.91,76.83 v43.18,75.56 | v59.05,75.56 v59.05,77.47 | v76.83,76.83 v76.83,74.93 | v93.34,75.56 93.98,76.2 v93.98,77.47
IBUS4  (via drill 0.3)  (1 unrouted)
  Top 0.203: v8.89,66.67 IC77.15 | v8.89,73.03 24.77,73.03 27.94,76.2 IC80.14 36.83,76.2 37.47,75.56 v37.47,66.67 | v41.91,66.67 IC68.15 v55.88,66.67 | v57.15,74.3 v59.69,74.3 | v59.69,76.2 IC71.14 v66.04,76.2 | v66.04,66.67 66.67,66.04 76.83,66.04 77.47,66.67 IC85.15 v90.17,66.67 | v91.44,74.93 v94.61,74.93 | v94.61,76.2 IC88.14
  Top 0.305: IC88.14 110.49,76.2 116.84,69.85 IC56.6
  Bottom 0.203: v8.89,66.67 v8.89,73.03 | v37.47,66.67 v41.91,66.67 | v55.88,66.67 55.88,73.03 v57.15,74.3 | v59.69,74.3 v59.69,76.2 | v66.04,76.2 v66.04,66.67 | v90.17,66.67 90.17,73.66 v91.44,74.93 | v94.61,74.93 v94.61,76.2
IBUS5  (via drill 0.3)  (1 unrouted)
  Top 0.203: IC77.1 6.99,67.94 8.89,69.85 22.86,69.85 27.94,74.93 IC80.13 36.45,74.93 37.08,74.3 37.08,68.45 v36.58,67.94 | v38.1,67.94 IC68.1 | v50.16,68.58 50.16,72.39 50.8,73.03 60.33,73.03 62.23,74.93 IC71.13 v66.67,74.93 | v66.67,67.94 IC85.1 76.83,67.94 77.47,67.31 v80.64,67.31 | v80.64,74.3 95.89,74.3 96.52,74.93 IC88.13
  Top 0.305: IC88.13 109.86,74.93 116.2,68.58 IC56.7
  Bottom 0.203: v36.58,67.94 v38.1,67.94 49.53,67.94 v50.16,68.58 | v66.67,74.93 v66.67,67.94 | v80.64,67.31 v80.64,74.3
IBUS6  (via drill 0.3)  (1 unrouted)
  Top 0.203: v8.26,67.94 9.53,69.22 22.86,69.22 27.3,73.66 IC80.12 36.07,73.66 36.58,73.15 36.58,68.96 35.94,68.33 35.94,61.85 37.47,60.33 IC68.10 v55.88,60.33 | v8.26,60.33 IC77.10 | v56.52,72.39 60.96,72.39 62.23,73.66 IC71.12 v67.31,73.66 | v67.31,60.33 v71.12,60.33 | v76.83,60.33 IC85.10 v81.28,60.33 | v81.28,73.03 95.89,73.03 96.52,73.66 IC88.12
  Top 0.305: IC88.12 109.22,73.66 115.57,67.31 IC56.8
  Bottom 0.203: v8.26,60.33 v8.26,67.94 | v55.88,60.33 55.88,65.41 56.52,66.04 v56.52,72.39 | v67.31,73.66 v67.31,60.33 | v71.12,60.33 v76.83,60.33 | v81.28,60.33 v81.28,73.03
IBUS7  (via drill 0.3)  (1 unrouted)
  Top 0.152: IC77.9 36.2,59.05
  Top 0.203: 36.2,59.05 36.83,59.69 | 36.83,59.69 41.91,59.69 42.55,59.05 IC68.9 v56.52,59.05 | v57.15,71.75 61.59,71.75 62.23,72.39 IC71.11 v67.94,72.39 | v67.94,59.69 v70.48,59.69 | v76.83,59.05 IC85.9 94.61,59.05 v95.25,59.69 | IC88.11 96.52,72.39 v95.89,71.75 | IC80.11 35.56,72.39 36.2,71.75 36.2,69.22 35.56,68.58 35.56,60.96 36.83,59.69
  Top 0.305: IC88.11 108.58,72.39 114.94,66.04 IC56.9
  Bottom 0.203: v56.52,59.05 56.52,64.77 57.15,65.41 v57.15,71.75 | v67.94,72.39 v67.94,59.69 | v70.48,59.69 76.2,59.69 v76.83,59.05 | IC60.1 96.93,59.69 v95.25,59.69 95.25,71.12 v95.89,71.75
IBUS8  (via drill 0.3)  (1 unrouted)
  Top 0.152: v46.35,64.14 61.59,64.14 62.23,64.77 IC72.18 v68.58,64.77 | v68.58,56.52 v73.03,56.52 | v80.64,56.52 80.64,50.16 IC86.15
  Top 0.203: IC89.18 99.69,64.77 103.5,60.96 103.5,57.15 v104.78,55.88 v111.12,49.53 | v111.12,40.64 114.94,36.83 IC57.2 | IC78.15 12.06,50.16 v12.06,52.7 | v12.06,65.41 26.04,65.41 26.67,64.77 IC81.18 v31.75,64.77 | v31.75,55.24 v36.83,55.24 | v45.72,50.16 IC69.15 43.81,50.16 43.18,50.8 v36.83,50.8
  Bottom 0.152: v45.72,50.16 46.35,50.8 v46.35,64.14 | v68.58,64.77 v68.58,56.52 | v73.03,56.52 v80.64,56.52 94.61,56.52 95.25,55.88 96.93,55.88 IC60.4
  Bottom 0.203: v111.12,49.53 v111.12,40.64 | IC60.4 104.65,56.01 v104.78,55.88 | v12.06,52.7 v12.06,65.41 | v31.75,64.77 v31.75,55.24 | v36.83,55.24 v36.83,50.8
IBUS9  (via drill 0.3)  (1 unrouted)
  Top 0.152: v82.55,54.61 v87.63,54.61 | v32.38,63.5 IC81.17 | IC78.1 5.08,51.61 5.08,54.61 v32.38,54.61 39.37,54.61 | 39.37,54.61 39.37,51.61 IC69.1 | 39.37,54.61 40.01,54.61 40.64,55.24 57.15,55.24 v57.78,55.88 | v57.78,63.5 IC72.17 71.12,63.5 71.12,61.59 71.75,60.96 71.75,57.15 74.3,57.15 v74.3,54.61 74.3,53.34 73.48,52.53 IC86.1
  Top 0.203: IC89.17 99.69,63.5 102.87,60.33 102.87,56.52 v104.78,54.61 v110.49,48.9 | v110.49,40.01 114.94,35.56 IC57.3
  Bottom 0.152: IC60.5 87.76,54.74 v87.63,54.61 | v74.3,54.61 v82.55,54.61 | v32.38,54.61 v32.38,63.5 | v57.78,55.88 v57.78,63.5
  Bottom 0.203: v110.49,48.9 v110.49,40.01 | IC60.5 104.65,54.74 v104.78,54.61
IBUS10  (via drill 0.3)  (1 unrouted)
  Top 0.152: IC78.10 v22.86,43.81 35.56,43.81 v36.2,44.45 | 29.84,62.23 IC81.16 v22.86,62.23 | v43.18,43.81 IC69.10 v59.69,43.81 69.85,43.81 70.48,44.45 v72.39,44.45 | v93.98,43.81 IC86.10 v77.47,43.81 | v59.05,61.59 59.69,62.23 IC72.16 | v106.05,44.45 108.58,44.45 109.22,45.09 v109.86,45.09
  Top 0.203: IC89.16 99.69,62.23 102.23,59.69 v102.23,58.42 102.23,55.88 v109.86,48.26 | v109.86,39.37 114.94,34.29 IC57.4
  Bottom 0.152: v22.86,43.81 v22.86,62.23 | v36.2,44.45 42.55,44.45 v43.18,43.81 | v93.98,43.81 105.41,43.81 v106.05,44.45 | v59.69,43.81 59.69,52.7 59.05,53.34 v59.05,61.59 | v72.39,44.45 76.83,44.45 v77.47,43.81 | v109.86,45.09 v109.86,39.37
  Bottom 0.203: v109.86,45.09 v109.86,48.26 | IC60.2 102.11,58.55 v102.23,58.42
IBUS11  (via drill 0.3)  (1 unrouted)
  Top 0.152: IC78.9 v21.59,42.55 37.47,42.55 v38.1,43.18 | v21.59,60.96 IC81.15 | v43.18,42.55 IC69.9 v66.67,42.55 69.85,42.55 70.48,43.18 v72.39,43.18 | v77.47,42.55 IC86.9 90.17,42.55 90.81,41.91 v94.61,41.91 | v66.04,60.96 IC72.15 | v106.05,43.18 v109.22,43.18
  Top 0.203: IC89.15 99.69,60.96 101.6,59.05 v101.6,57.15 101.6,55.24 v109.22,47.62 | v109.22,38.73 114.94,33.02 IC57.5
  Bottom 0.152: v21.59,42.55 v21.59,60.96 | v38.1,43.18 42.55,43.18 v43.18,42.55 | v72.39,43.18 76.83,43.18 v77.47,42.55 | v66.04,60.96 66.04,60.33 67.31,59.05 67.31,54.61 66.67,53.98 v66.67,42.55 | v94.61,41.91 95.25,42.55 105.41,42.55 v106.05,43.18 | v109.22,43.18 v109.22,47.62
  Bottom 0.203: v109.22,43.18 v109.22,38.73 | IC60.3 101.47,57.28 v101.6,57.15
IBUS12  (via drill 0.3)  (1 unrouted)
  Top 0.152: v80.01,33.66 IC87.15 | IC79.15 v22.23,33.66 36.2,33.66 36.83,34.29 42.16,34.29 42.8,33.66 IC70.15 v46.99,33.66 | v22.23,59.69 IC81.14 | v46.99,53.98 57.78,53.98 v58.42,54.61 72.39,54.61 v73.03,55.24 | v58.42,59.69 IC72.14 | v81.28,55.88 v81.28,45.72 | v81.28,35.56 81.53,35.31 93.47,35.31 95.12,33.66 102.62,33.66 107.06,38.1 v108.58,38.1
  Top 0.203: IC89.14 99.69,59.69 100.97,58.42 100.97,54.61 v108.58,46.99 | v108.58,38.1 v112.71,33.97 114.94,31.75 IC57.6
  Bottom 0.152: v22.23,33.66 v22.23,59.69 | v46.99,33.66 v46.99,53.98 | v58.42,54.61 v58.42,59.69 | v73.03,55.24 73.66,55.88 v81.28,55.88 | v81.28,45.72 v81.28,35.56 81.28,34.92 v80.01,33.66
  Bottom 0.203: v108.58,38.1 v108.58,46.99
IBUS13  (via drill 0.3)  (1 unrouted)
  Top 0.152: IC79.1 v2.54,34.92 | IC81.13 28.57,58.42 v27.94,57.78 v5.08,57.78 | v36.2,34.92 IC70.1 42.55,34.92 43.18,34.29 50.8,34.29 51.44,33.66 65.41,33.66 v66.67,34.92 IC87.1 93.34,34.92 95.89,32.38 101.85,32.38 106.93,37.47 v107.95,37.47 | v66.67,58.42 IC72.13
  Top 0.203: IC89.13 99.69,58.42 100.33,57.78 100.33,53.98 v107.95,46.35 | v107.95,37.47 v109.86,35.56 114.94,30.48 IC57.7
  Bottom 0.152: v2.54,34.92 2.54,55.24 v5.08,57.78 | v27.94,57.78 27.94,48.26 36.2,40.01 v36.2,34.92 | v66.67,58.42 66.67,55.24 66.04,54.61 66.04,35.56 v66.67,34.92
  Bottom 0.203: v107.95,37.47 v107.95,46.35
IBUS14  (via drill 0.3)  (1 unrouted)
  Top 0.152: IC70.10 71.75,27.3 72.39,27.94 76.83,27.94 77.47,27.3 IC87.10 v93.98,27.3 | 99.69,57.15 96.52,57.15 95.89,57.78 v76.83,57.78 | v69.22,57.15 IC72.12
  Top 0.203: IC79.10 v36.83,27.3 | v43.18,27.3 IC70.10 | IC89.12 99.69,57.15 99.69,53.34 v107.31,45.72 | v107.31,36.83 v114.94,29.21 IC57.8 | IC81.12 43.81,57.15 44.45,57.78 61.59,57.78 62.23,57.15 IC72.12
  Bottom 0.152: v93.98,27.3 113.03,27.3 v114.94,29.21 | v76.83,57.78 76.2,57.15 v69.22,57.15
  Bottom 0.203: v36.83,27.3 v43.18,27.3 | v107.31,36.83 v107.31,45.72
IBUS15  (via drill 0.3)  (1 unrouted)
  Top 0.152: v94.61,25.4 90.81,25.4 90.17,26.04 IC87.9 77.47,26.04 76.83,26.67 v66.67,26.67 66.04,26.67 65.41,26.04 IC70.9 | v66.04,55.88 IC72.11
  Top 0.203: IC79.9 v36.83,26.04 | v42.55,26.04 IC70.9 | IC89.11 98.37,53.39 v106.68,45.09 | v106.68,36.2 114.94,27.94 v116.2,27.94 IC57.9 | IC81.11 45.09,55.88 45.72,56.52 60.96,56.52 61.59,55.88 IC72.11
  Bottom 0.152: v94.61,25.4 95.25,26.04 114.3,26.04 v116.2,27.94 | v66.67,26.67 66.67,31.11 65.41,32.38 65.41,55.24 v66.04,55.88
  Bottom 0.203: v36.83,26.04 37.47,26.67 41.91,26.67 v42.55,26.04 | v106.68,36.2 v106.68,45.09
N$70  (via drill 0.3)
  Top 0.203: IC68.5 41.27,62.87 41.27,74.3 55.88,74.3 v56.52,74.93 | v56.52,80.64 51.31,80.64 50.04,79.38 IC67.12
  Bottom 0.203: v56.52,74.93 v56.52,80.64
N$71  (1 unrouted)
N$95  (1 unrouted)
N$734  (1 unrouted)
N$736  (via drill 0.3)
  Top 0.203: J1.1 61.59,17.14 62.23,17.14 v62.23,19.68 | v60.96,48.26 IC73.18
  Bottom 0.203: v62.23,19.68 62.23,32.38 59.05,35.56 59.05,40.64 62.23,43.81 62.23,45.09 60.96,46.35 v60.96,48.26
N$737  (via drill 0.3)
  Top 0.203: J1.2 62.87,12.7 v62.87,20.32 | v62.23,46.99 IC73.17
  Bottom 0.203: v62.87,20.32 62.87,33.02 59.69,36.2 59.69,40.01 62.87,43.18 62.87,45.72 62.23,46.35 v62.23,46.99
N$738  (via drill 0.3)
  Top 0.203: v57.78,45.72 IC73.16
  Bottom 0.203: J1.3 59.05,17.14 57.15,19.05 57.15,36.83 57.78,37.47 v57.78,45.72
N$740  (via drill 0.3)
  Top 0.203: J1.4 60.33,13.97 60.33,17.78 61.59,17.78 v61.59,19.05 | v61.59,44.45 IC73.15
  Bottom 0.203: v61.59,19.05 61.59,31.75 58.42,34.92 58.42,41.27 v61.59,44.45
N$741  (via drill 0.3)
  Top 0.203: v56.52,43.18 IC73.14
  Bottom 0.203: J1.5 56.52,17.14 55.88,17.78 55.88,38.1 56.52,38.73 v56.52,43.18
N$742  (via drill 0.3)
  Top 0.203: v57.15,41.91 IC73.13
  Bottom 0.203: J1.6 57.78,13.97 57.78,17.14 56.52,18.41 56.52,37.47 57.15,38.1 v57.15,41.91
N$743  (via drill 0.3)
  Top 0.203: v55.88,40.39 56.13,40.64 IC73.12
  Bottom 0.203: J1.7 53.98,17.14 54.61,17.78 54.61,39.12 v55.88,40.39
N$744  (via drill 0.3)
  Top 0.203: v55.88,39.37 IC73.11
  Bottom 0.203: J1.8 55.24,13.97 55.24,38.73 v55.88,39.37
N$745  (via drill 0.3)
  Top 0.152: 52.7,18.41 53.34,19.05 v60.33,19.05
  Top 0.305: v60.33,31.75 IC74.18
  Top 0.406: J1.9 51.44,17.14 52.7,18.41
  Bottom 0.152: v60.33,19.05 v60.33,31.75
N$746  (via drill 0.3)
  Top 0.152: 53.34,17.78 53.98,18.41 v60.96,18.41
  Top 0.305: v60.96,30.48 IC74.17
  Top 0.406: J1.10 52.7,13.97 52.7,17.14 53.34,17.78
  Bottom 0.152: v60.96,18.41 v60.96,30.48
N$747  (via drill 0.3)
  Top 0.152: 51.44,19.68 52.07,20.32 v59.05,20.32
  Top 0.305: v59.05,29.21 IC74.16
  Top 0.406: J1.11 48.9,17.14 51.44,19.68
  Bottom 0.152: v59.05,20.32 v59.05,29.21
N$748  (via drill 0.3)
  Top 0.152: 52.07,19.05 52.7,19.68 v59.69,19.68
  Top 0.305: v59.69,27.94 IC74.15
  Top 0.406: J1.12 50.16,13.97 50.16,17.14 52.07,19.05
  Bottom 0.152: v59.69,19.68 v59.69,27.94
N$749  (via drill 0.3)
  Top 0.152: 50.16,20.95 50.8,21.59 v57.78,21.59
  Top 0.305: v57.78,26.67 IC74.14
  Top 0.406: J1.13 46.35,17.14 50.16,20.95
  Bottom 0.152: v57.78,21.59 v57.78,26.67
N$750  (via drill 0.3)
  Top 0.152: 50.8,20.32 51.44,20.95 v58.42,20.95
  Top 0.305: v58.42,25.4 IC74.13
  Top 0.406: J1.14 47.62,13.97 47.62,17.14 50.8,20.32
  Bottom 0.152: v58.42,20.95 v58.42,25.4
N$751
  Top 0.152: 49.53,22.86 50.16,23.5 61.59,23.5 62.23,24.13 IC74.12
  Top 0.406: J1.15 43.81,17.14 49.53,22.86
N$752
  Top 0.152: 49.53,21.59 50.16,22.23 61.59,22.23 62.23,22.86 IC74.11
  Top 0.406: J1.16 45.09,13.97 45.09,17.14 49.53,21.59
N$753  (via drill 0.3)
  Top 0.203: v26.67,48.26 IC82.18
  Bottom 0.203: J1.17 41.27,15.88 34.92,22.23 34.92,38.73 26.67,46.99 v26.67,48.26
N$754  (via drill 0.3)
  Top 0.203: v27.94,46.99 IC82.17
  Bottom 0.203: J1.18 42.55,13.97 42.55,15.88 35.56,22.86 35.56,39.37 v27.94,46.99
N$755  (via drill 0.3)
  Top 0.203: v26.67,45.72 IC82.16
  Bottom 0.203: J1.19 38.73,15.88 33.66,20.95 33.66,37.47 26.67,44.45 v26.67,45.72
N$756  (via drill 0.3)
  Top 0.203: v27.94,44.45 IC82.15
  Bottom 0.203: J1.20 40.01,13.97 40.01,15.88 34.29,21.59 34.29,38.1 v27.94,44.45
N$757  (via drill 0.3)
  Top 0.203: v26.67,43.18 IC82.14
  Bottom 0.203: J1.21 36.2,15.88 32.38,19.68 32.38,36.2 26.67,41.91 v26.67,43.18
N$758  (via drill 0.3)
  Top 0.203: v27.94,41.91 IC82.13
  Bottom 0.203: J1.22 37.47,13.97 37.47,15.88 33.02,20.32 33.02,36.83 v27.94,41.91
N$759  (via drill 0.3)
  Top 0.203: v26.67,40.64 IC82.12
  Bottom 0.203: J1.23 33.66,15.88 31.11,18.41 31.11,34.92 26.67,39.37 v26.67,40.64
N$760  (via drill 0.3)
  Top 0.203: v27.94,39.37 IC82.11
  Bottom 0.203: J1.24 34.92,13.97 34.92,15.88 31.75,19.05 31.75,35.56 v27.94,39.37
N$761  (via drill 0.3)
  Top 0.203: v27.94,31.75 IC83.18
  Bottom 0.203: 31.11,15.88 28.57,18.41 28.57,21.59 29.84,22.86 29.84,29.21 29.21,29.84 27.05,29.84 27.05,31.75 v27.94,31.75
  Bottom 0.406: J1.25 31.11,15.88
N$762  (via drill 0.3)
  Top 0.203: v27.94,30.48 IC83.17
  Bottom 0.203: 32.38,15.88 29.21,19.05 29.21,20.95 30.48,22.23 30.48,29.46 29.46,30.48 v27.94,30.48
  Bottom 0.406: J1.26 32.38,13.97 32.38,15.88
N$763  (via drill 0.3)
  Top 0.203: v27.94,29.21 IC83.16
  Bottom 0.203: 28.57,15.88 27.3,17.14 27.3,23.5 28.57,24.77 28.57,27.3 27.05,27.3 27.05,29.21 v27.94,29.21
  Bottom 0.406: 28.57,15.88 J1.27
N$764  (via drill 0.3)
  Top 0.203: v27.94,27.94 IC83.15
  Bottom 0.203: 29.84,15.88 27.94,17.78 27.94,22.86 29.21,24.13 29.21,27.94 v27.94,27.94
  Bottom 0.406: J1.28 29.84,13.97 29.84,15.88
N$765  (via drill 0.3)
  Top 0.203: v27.94,26.67 IC83.14
  Bottom 0.203: J1.29 26.04,24.77 v27.94,26.67
N$766  (via drill 0.3)
  Top 0.203: v27.94,25.4 IC83.13
  Bottom 0.203: 27.3,15.88 26.67,16.51 26.67,24.13 v27.94,25.4
  Bottom 0.406: J1.30 27.3,13.97 27.3,15.88
N$767  (via drill 0.3)
  Top 0.203: v24.77,23.5 25.4,24.13 IC83.12
  Bottom 0.203: 23.5,16.51 24.77,17.78 v24.77,23.5
  Bottom 0.406: J1.31 23.5,16.51
N$768  (via drill 0.3)
  Top 0.203: v25.4,22.23 26.04,22.86 IC83.11
  Bottom 0.203: 24.77,15.88 25.4,16.51 v25.4,22.23
  Bottom 0.406: J1.32 24.77,13.97 24.77,15.88
N$773  (via drill 0.3)
  Top 0.203: J2.1 122.56,16.51 111.76,27.3 111.76,29.84 v106.05,35.56 | v106.05,41.91 99.69,48.26 IC93.18
  Bottom 0.203: v106.05,35.56 v106.05,41.91
N$775  (via drill 0.3)
  Top 0.203: J2.2 121.28,13.97 121.28,16.51 111.12,26.67 111.12,29.21 v105.41,34.92 | v105.41,41.27 99.69,46.99 IC93.17 97.79,46.99
  Bottom 0.203: v105.41,34.92 v105.41,41.27
N$776  (via drill 0.3)
  Top 0.203: J2.3 120.02,16.51 110.49,26.04 110.49,28.57 v104.78,34.29 | v104.78,40.64 99.69,45.72 IC93.16
  Bottom 0.203: v104.78,34.29 v104.78,40.64
N$777  (via drill 0.3)
  Top 0.203: J2.4 118.75,13.97 118.75,16.51 109.86,25.4 109.86,27.94 v104.14,33.66 | v104.14,40.01 99.69,44.45 IC93.15
  Bottom 0.203: v104.14,33.66 v104.14,40.01
N$778  (via drill 0.3)
  Top 0.203: J2.5 117.47,16.51 109.22,24.77 109.22,27.3 v103.5,33.02 | v103.5,39.37 99.69,43.18 IC93.14
  Bottom 0.203: v103.5,33.02 v103.5,39.37
N$779  (via drill 0.3)
  Top 0.203: J2.6 116.2,13.97 116.2,16.51 108.58,24.13 108.58,26.67 v102.87,32.38 | v102.87,38.73 99.69,41.91 IC93.13
  Bottom 0.203: v102.87,32.38 v102.87,38.73
N$780  (via drill 0.3)
  Top 0.203: J2.7 114.94,16.51 107.31,24.13 107.31,26.67 v102.23,31.75 | v102.23,38.1 99.69,40.64 IC93.12
  Bottom 0.203: v102.23,31.75 v102.23,38.1
N$781  (via drill 0.3)
  Top 0.152: IC93.11 99.69,39.37 v101.6,37.47
  Top 0.203: J2.8 113.67,13.97 113.67,16.51 108.58,21.59 106.05,21.59 104.78,22.86 104.78,27.94 v101.6,31.11
  Bottom 0.203: v101.6,31.11 v101.6,37.47
N$782
  Top 0.203: J2.9 112.39,16.51 107.95,20.95 105.41,20.95 104.14,22.23 104.14,27.3 99.69,31.75 IC94.18
N$783
  Top 0.203: J2.10 111.12,13.97 111.12,16.51 107.31,20.32 104.78,20.32 103.5,21.59 103.5,26.67 99.69,30.48 IC94.17
N$784
  Top 0.203: J2.11 109.86,16.51 106.68,19.68 104.14,19.68 102.87,20.95 102.87,26.04 99.69,29.21 IC94.16
N$785
  Top 0.203: J2.12 108.58,13.97 108.58,16.51 106.05,19.05 103.5,19.05 102.23,20.32 102.23,25.4 99.69,27.94 IC94.15
N$786
  Top 0.203: IC94.14 99.69,26.67 101.6,24.77 101.6,19.68 102.87,18.41 105.41,18.41 107.31,16.51 J2.13
N$787
  Top 0.203: IC94.13 99.69,25.4 100.97,24.13 100.97,19.05 102.23,17.78 104.78,17.78 106.05,16.51 106.05,13.97 J2.14
N$788
  Top 0.203: IC94.12 99.69,24.13 100.33,23.5 100.33,18.41 101.6,17.14 104.14,17.14 104.78,16.51 J2.15
N$789
  Top 0.203: J2.16 103.5,13.97 103.5,16.51 100.97,16.51 99.06,18.41 98.37,19.05 IC94.11
N$793
  Bottom 0.203: IC91.1 23.55,69.85 24.18,70.48 42.55,70.48 43.18,71.12 IC90.19
PC0  (1 unrouted)
  Top 0.203: IC67.3 42.55,81.92 43.18,82.55 IC71.2
PC1  (via drill 0.3)  (1 unrouted)
  Top 0.152: IC73.3 v55.88,48.26
  Top 0.203: IC67.2 38.1,83.19 38.1,81.28 IC71.3
PC2  (1 unrouted)
  Top 0.203: IC67.6 41.27,78.11 41.91,78.74 50.16,78.74 51.44,80.01 IC71.4
PC3  (1 unrouted)
  Top 0.203: IC67.7 41.91,76.83 42.55,77.47 50.8,77.47 52.07,78.74 IC71.5
PC4  (via drill 0.3)  (1 unrouted)
  Top 0.203: v37.47,65.41 IC68.3 | v41.91,62.23 v37.47,62.23 | IC73.6 42.93,44.45 42.93,49.15 v41.91,50.16
  Bottom 0.203: v37.47,62.23 v37.47,65.41 | v41.91,50.16 v41.91,62.23
PC5  (1 unrouted)
  Top 0.203: IC68.2 40.64,66.67 40.64,76.2 IC71.7
PC6  (via drill 0.3)  (1 unrouted)
  Top 0.203: v41.27,61.59 IC68.6 | IC73.8 42.55,41.91 42.55,48.51 v41.91,49.15
  Bottom 0.203: v41.91,49.15 41.27,49.78 v41.27,61.59
PC7  (via drill 0.3)  (1 unrouted)
  Top 0.203: v40.64,60.33 IC68.7 | IC73.9 52.07,40.64 52.07,41.53 42.29,41.53 41.91,41.91 41.91,48.01 40.64,49.28 v40.64,50.16
  Bottom 0.203: v40.64,50.16 v40.64,60.33
PC8  (via drill 0.3)  (1 unrouted)
  Top 0.203: IC69.3 40.26,48.9 41.4,47.75 41.4,41.78 42.04,41.15 48.64,41.15 v48.9,40.89 | v48.9,33.02 IC74.2
  Bottom 0.203: v48.9,33.02 v48.9,40.89
PC9  (via drill 0.3)  (1 unrouted)
  Top 0.203: IC69.2 38.1,50.16 38.1,48.26 40.26,48.26 41.02,47.5 41.02,41.4 41.66,40.77 47.75,40.77 v48.26,40.26 | v48.26,31.75 IC74.3
  Bottom 0.203: v48.26,31.75 v48.26,40.26
PC10  (via drill 0.3)  (2 unrouted)
  Top 0.203: IC69.6 40.64,45.09 40.64,41.02 41.27,40.39 46.86,40.39 v47.62,39.62 | v47.62,31.11 48.26,30.48 IC74.4
  Bottom 0.203: v47.62,31.11 v47.62,39.62
PC11  (via drill 0.3)  (2 unrouted)
  Top 0.203: v37.47,43.81 IC69.7 | IC74.5 47.62,29.21 46.35,30.48 43.56,30.48 41.02,33.02 v37.47,33.02
  Bottom 0.203: v37.47,33.02 37.47,41.27 36.83,41.91 36.83,43.18 v37.47,43.81
PC12  (2 unrouted)
  Top 0.203: IC70.3 40.64,32.38 40.64,29.21 45.72,29.21 46.99,27.94 IC74.6
PC13  (2 unrouted)
  Top 0.203: IC70.2 41.66,33.66 43.56,31.75 45.72,31.75 47.62,29.84 55.88,29.84 55.88,26.67 IC74.7
PC14  (2 unrouted)
  Top 0.203: IC70.6 40.64,28.57 41.27,27.94 41.27,26.04 41.91,25.4 IC74.8
PC15  (via drill 0.3)  (1 unrouted)
  Top 0.203: IC70.7 40.64,27.3 40.64,24.77 41.27,24.13 v52.07,24.13 IC74.9 | v52.07,57.15 IC72.9
  Bottom 0.203: v52.07,24.13 v52.07,57.15
RESET  (via drill 0.3)  (11 unrouted)
  Top 0.152: v11.43,32.38 IC79.14 | v11.43,20.95 v43.81,20.95 | IC67.14 v45.72,81.92 | v46.35,85.09 59.69,85.09 61.59,83.19 v71.75,83.19 75.56,83.19 v76.2,82.55 | 81.92,81.28 IC84.14 v76.2,81.28
  Bottom 0.152: v11.43,20.95 v11.43,32.38 | v45.72,81.92 45.72,84.45 v46.35,85.09 | v76.2,82.55 v76.2,81.28
VCC  (via drill 0.3)  (38 unrouted)
  Bottom 0.152: IC91.20 v27.43,69.85
  Bottom 0.305: IC1.5 142.21,59.02 v142.24,59.05 | IC63.14 106.68,59.28 v106.68,60.45 | IC63.1 113.03,59.28 v113.03,60.45 | IC75.16 118.75,89 v118.75,90.17 | v95.25,53.47 IC60.6 | IC60.16 90.81,59.92 v90.81,61.09 | v128.27,35.56 IC65.16
  pour Top (isolate 0.305, no thermals): 0,99.69 0,-0.64 160.02,-0.64 160.02,99.69